# Altium project PCB_L298_Board.PrjPcb
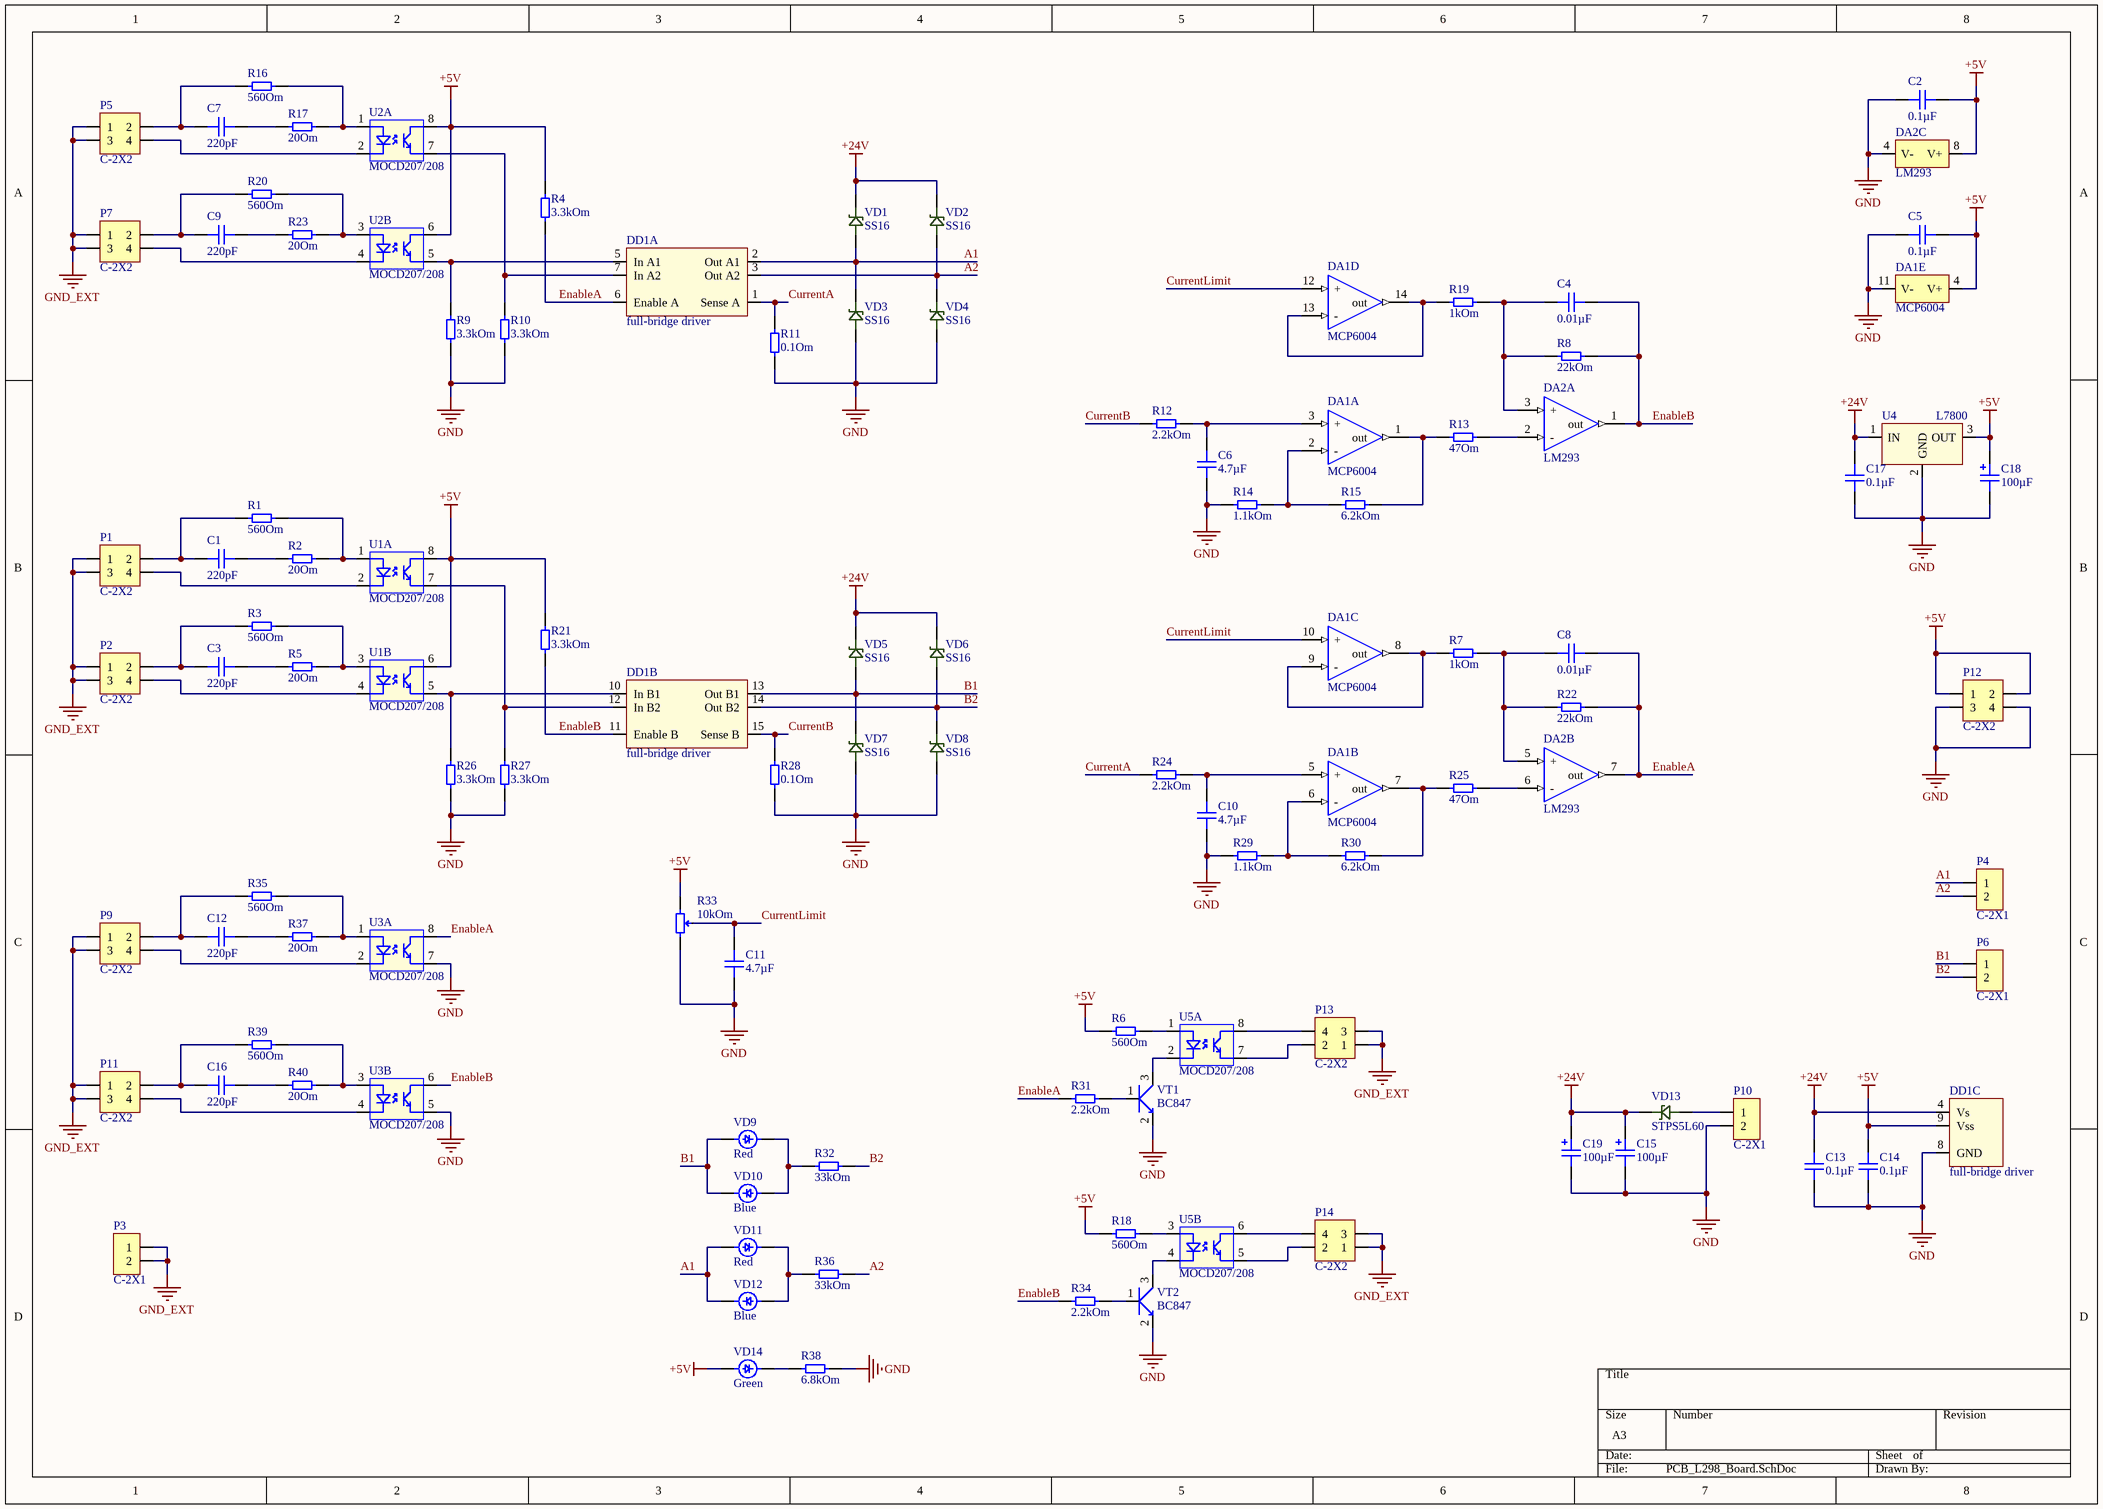
[diagram p0: PCB_L298_Board.SchDoc]
1 sheet, 96 parts. Net scope: global (net labels, ports and power ports of the same name join across sheets).
Board file: PCB_L298_Board.PcbDoc

## Sheet PCB_L298_Board.SchDoc
size A3

### Parts
C1  capacity: 220pF  [SMD-1206]  (hidden comment: Ceramic)
C2  capacity: 0.1µF  [SMD-1206]  (hidden comment: Ceramic)
C3  capacity: 220pF  [SMD-1206]  (hidden comment: Ceramic)
C4  capacity: 0.01µF  [SMD-1206]  (hidden comment: Ceramic)
C5  capacity: 0.1µF  [SMD-1206]  (hidden comment: Ceramic)
C6  capacity: 4.7µF  [SMD-1206]  (hidden comment: Ceramic)
C7  capacity: 220pF  [SMD-1206]  (hidden comment: Ceramic)
C8  capacity: 0.01µF  [SMD-1206]  (hidden comment: Ceramic)
C9  capacity: 220pF  [SMD-1206]  (hidden comment: Ceramic)
C10  capacity: 4.7µF  [SMD-1206]  (hidden comment: Ceramic)
C11  capacity: 4.7µF  [SMD-1206]  (hidden comment: Ceramic)
C12  capacity: 220pF  [SMD-1206]  (hidden comment: Ceramic)
C13  capacity: 0.1µF  [SMD-1206]  (hidden comment: Ceramic)
C14  capacity: 0.1µF  [SMD-1206]  (hidden comment: Ceramic)
C15  capacity: 100µF  [BAR-(8-11)(3.175)]  (hidden comment: Polar)
C16  capacity: 220pF  [SMD-1206]  (hidden comment: Ceramic)
C17  capacity: 0.1µF  [SMD-1206]  (hidden comment: Ceramic)
C18  capacity: 100µF  [BAR-(6.3-11)(2.54)]  (hidden comment: Polar)
C19  capacity: 100µF  [BAR-(8-11)(3.175)]  (hidden comment: Polar)
DA1  MCP6004  [SOP-14]  (parts A,B,C,D,E of 5)
DA2  LM293  [SOP-8]  (parts A,B,C of 3)
DD1  full-bridge driver  [MULTIWATT-15]  (parts A,B,C of 3)
P1  C-2X2  [C-2X2(2.54)]
P2  C-2X2  [C-2X2(2.54)]
P3  C-2X1  [C-2X1(2.54)]
P4  C-2X1  [CB2-10-11-X(5.08)]
P5  C-2X2  [C-2X2(2.54)]
P6  C-2X1  [CB2-10-11-X(5.08)]
P7  C-2X2  [C-2X2(2.54)]
P9  C-2X2  [C-2X2(2.54)]
P10  C-2X1  [CB2-10-11-X(5.08)]
P11  C-2X2  [C-2X2(2.54)]
P12  C-2X2  [C-2X2(2.54)]
P13  C-2X2  [C-2X2(2.54)]
P14  C-2X2  [C-2X2(2.54)]
R1  value 560Om  [SMD-1206]  (hidden comment: Resistor)
R2  value 20Om  [SMD-1206]  (hidden comment: Resistor)
R3  value 560Om  [SMD-1206]  (hidden comment: Resistor)
R4  value 3.3kOm  [SMD-1206]  (hidden comment: Resistor)
R5  value 20Om  [SMD-1206]  (hidden comment: Resistor)
R6  value 560Om  [SMD-1206]  (hidden comment: Resistor)
R7  value 1kOm  [SMD-1206]  (hidden comment: Resistor)
R8  value 22kOm  [SMD-1206]  (hidden comment: Resistor)
R9  value 3.3kOm  [SMD-1206]  (hidden comment: Resistor)
R10  value 3.3kOm  [SMD-1206]  (hidden comment: Resistor)
R11  value 0.1Om  [SMD-2512]  (hidden comment: Resistor)
R12  value 2.2kOm  [SMD-1206]  (hidden comment: Resistor)
R13  value 47Om  [SMD-1206]  (hidden comment: Resistor)
R14  value 1.1kOm  [SMD-1206]  (hidden comment: Resistor)
R15  value 6.2kOm  [SMD-1206]  (hidden comment: Resistor)
R16  value 560Om  [SMD-1206]  (hidden comment: Resistor)
R17  value 20Om  [SMD-1206]  (hidden comment: Resistor)
R18  value 560Om  [SMD-1206]  (hidden comment: Resistor)
R19  value 1kOm  [SMD-1206]  (hidden comment: Resistor)
R20  value 560Om  [SMD-1206]  (hidden comment: Resistor)
R21  value 3.3kOm  [SMD-1206]  (hidden comment: Resistor)
R22  value 22kOm  [SMD-1206]  (hidden comment: Resistor)
R23  value 20Om  [SMD-1206]  (hidden comment: Resistor)
R24  value 2.2kOm  [SMD-1206]  (hidden comment: Resistor)
R25  value 47Om  [SMD-1206]  (hidden comment: Resistor)
R26  value 3.3kOm  [SMD-1206]  (hidden comment: Resistor)
R27  value 3.3kOm  [SMD-1206]  (hidden comment: Resistor)
R28  value 0.1Om  [SMD-2512]  (hidden comment: Resistor)
R29  value 1.1kOm  [SMD-1206]  (hidden comment: Resistor)
R30  value 6.2kOm  [SMD-1206]  (hidden comment: Resistor)
R31  value 2.2kOm  [SMD-1206]  (hidden comment: Resistor)
R32  value 33kOm  [SMD-1206]  (hidden comment: Resistor)
R33  Resistance: 10kOm  [3296(bot only)]  (hidden comment: Tuning)
R34  value 2.2kOm  [SMD-1206]  (hidden comment: Resistor)
R35  value 560Om  [SMD-1206]  (hidden comment: Resistor)
R36  value 33kOm  [SMD-1206]  (hidden comment: Resistor)
R37  value 20Om  [SMD-1206]  (hidden comment: Resistor)
R38  value 6.8kOm  [SMD-1206]  (hidden comment: Resistor)
R39  value 560Om  [SMD-1206]  (hidden comment: Resistor)
R40  value 20Om  [SMD-1206]  (hidden comment: Resistor)
U1  MOCD207/208  [SOP-8]  (parts A,B of 2)
U2  MOCD207/208  [SOP-8]  (parts A,B of 2)
U3  MOCD207/208  [SOP-8]  (parts A,B of 2)
U4  L7800  [TO-220(EX-1)]
U5  MOCD207/208  [SOP-8]  (parts A,B of 2)
VD1  SS16  [SMB(DO-214AA)]
VD2  SS16  [SMB(DO-214AA)]
VD3  SS16  [SMB(DO-214AA)]
VD4  SS16  [SMB(DO-214AA)]
VD5  SS16  [SMB(DO-214AA)]
VD6  SS16  [SMB(DO-214AA)]
VD7  SS16  [SMB(DO-214AA)]
VD8  SS16  [SMB(DO-214AA)]
VD9  Red  [SMD-1206]
VD10  Blue  [SMD-1206]
VD11  Red  [SMD-1206]
VD12  Blue  [SMD-1206]
VD13  STPS5L60  [SMC(DO-214AB)]
VD14  Green  [SMD-1206]
VT1  BC847  [SOT-23]
VT2  BC847  [SOT-23]

### Nets
+5V: C2.2 C5.1 C14.1 C18.2 DA1.4(V+) DA2.8(V+) DD1.9(Vss) P12.1 P12.2 R4.2 R6.2 R18.2 R21.2 R33.1 U1.6 U1.8 U2.6 U2.8 U4.3(OUT) VD14.1
+24V: C13.1 C15.2 C17.1 C19.2 DD1.4(Vs) U4.1(IN) VD1.2 VD2.2 VD5.2 VD6.2 VD13.2
GND: C2.1 C5.2 C6.2 C10.2 C11.2 C13.2 C14.2 C15.1 C17.2 C18.1 C19.1 DA1.11(V-) DA2.4(V-) DD1.8(GND) P10.2 P12.3 P12.4 R9.1 R10.1 R11.1 R14.2 R26.1 R27.1 R28.1 R29.2 R33.3 R38.1 U3.5 U3.7 U4.2(GND) VD3.1 VD4.1 VD7.1 VD8.1 VT1.2(E) VT2.2(E)
GND_EXT: P1.1 P1.3 P2.1 P2.3 P3.1 P3.2 P5.1 P5.3 P7.1 P7.3 P9.1 P9.3 P11.1 P11.3 P13.1 P13.3 P14.1 P14.3
A1: DD1.2(Out_A1) P4.1 VD1.1 VD3.2 VD11.1 VD12.2
A2: DD1.3(Out_A2) P4.2 R36.1 VD2.1 VD4.2
B1: DD1.13(Out_B1) P6.1 VD5.1 VD7.2 VD9.1 VD10.2
B2: DD1.14(Out_B2) P6.2 R32.1 VD6.1 VD8.2
CurrentA: DD1.1(Sense_A) R11.2 R24.2
CurrentB: DD1.15(Sense_B) R12.2 R28.2
CurrentLimit: C11.1 DA1.10(+) DA1.12(+) R33.2
EnableA: C8.2 DA2.7(out) DD1.6(Enable_A) R4.1 R22.2 R31.2 U3.8
EnableB: C4.2 DA2.1(out) DD1.11(Enable_B) R8.2 R21.1 R34.2 U3.6
NetC1_1: C1.1 P1.2 R1.2
NetC1_2: C1.2 R2.2
NetC3_1: C3.1 P2.2 R3.2
NetC3_2: C3.2 R5.2
NetC4_1: C4.1 DA2.3(+) R8.1 R19.1
NetC6_1: C6.1 DA1.3(+) R12.1
NetC7_1: C7.1 P5.2 R16.2
NetC7_2: C7.2 R17.2
NetC8_1: C8.1 DA2.5(+) R7.1 R22.1
NetC9_1: C9.1 P7.2 R20.2
NetC9_2: C9.2 R23.2
NetC10_1: C10.1 DA1.5(+) R24.1
NetC12_1: C12.1 P9.2 R35.2
NetC12_2: C12.2 R37.2
NetC16_1: C16.1 P11.2 R39.2
NetC16_2: C16.2 R40.2
NetDA1_1: DA1.1(out) R13.2 R15.1
NetDA1_2: DA1.2(-) R14.1 R15.2
NetDA1_6: DA1.6(-) R29.1 R30.2
NetDA1_7: DA1.7(out) R25.2 R30.1
NetDA1_8: DA1.8(out) DA1.9(-) R7.2
NetDA1_13: DA1.13(-) DA1.14(out) R19.2
NetDA2_2: DA2.2(-) R13.1
NetDA2_6: DA2.6(-) R25.1
NetDD1_5: DD1.5(In_A1) R9.2 U2.5
NetDD1_7: DD1.7(In_A2) R10.2 U2.7
NetDD1_10: DD1.10(In_B1) R26.2 U1.5
NetDD1_12: DD1.12(In_B2) R27.2 U1.7
NetP1_4: P1.4 U1.2
NetP2_4: P2.4 U1.4
NetP5_4: P5.4 U2.2
NetP7_4: P7.4 U2.4
NetP9_4: P9.4 U3.2
NetP10_1: P10.1 VD13.1
NetP11_4: P11.4 U3.4
NetP13_2: P13.2 U5.7
NetP13_4: P13.4 U5.8
NetP14_2: P14.2 U5.5
NetP14_4: P14.4 U5.6
NetR1_1: R1.1 R2.1 U1.1
NetR3_1: R3.1 R5.1 U1.3
NetR6_1: R6.1 U5.1
NetR16_1: R16.1 R17.1 U2.1
NetR18_1: R18.1 U5.3
NetR20_1: R20.1 R23.1 U2.3
NetR31_1: R31.1 VT1.1(B)
NetR32_2: R32.2 VD9.2 VD10.1
NetR34_1: R34.1 VT2.1(B)
NetR35_1: R35.1 R37.1 U3.1
NetR36_2: R36.2 VD11.2 VD12.1
NetR38_2: R38.2 VD14.2
NetR39_1: R39.1 R40.1 U3.3
NetU5_2: U5.2 VT1.3(C)
NetU5_4: U5.4 VT2.3(C)

### Library data of the parts
DA1 = MCP6004: 1 MHz, Low-Power Op Amp
DA2 = LM293: Low Power Dual Voltage Comparators
DD1 = L298: High voltage, high current dual full-bridge driver designed to accept standard TTL logic levels and drive / inductive loads such as relays, solenoids, DC and / stepping motors.
U1-U3 U5 = MOCD207/208: Dual-channel Phototransistor Small Outline Surface / Mount Optocouplers
U4 = L7800: L7800 series of three-terminal positive regulators
VD1-VD8 = SS16: SURFACE MOUNT SCHOTTKY BARRIER RECTIFIERS / Reverse Voltage - 20 to 100 V / Forward Current - 1 A
VD9-VD12 VD14 = Led: universal template
VD13 = STPS5L60: 5 A - 60 V power Schottky rectifier
VT1 VT2 = BC847: NPN Plastic-Encapsulate Transistors